# EasyEDA Pro project SimGEKI2_Side.epro

# Schematic Side New
Board Name: Side New; Create Date: 2025-03-21; Page Name: P1; Project Name: ongeki-controller; Schematic Name: Side New; Update Date: 2025-04-07; Company: 嘉立创EDA; Page Size: A4; Version: V1.3
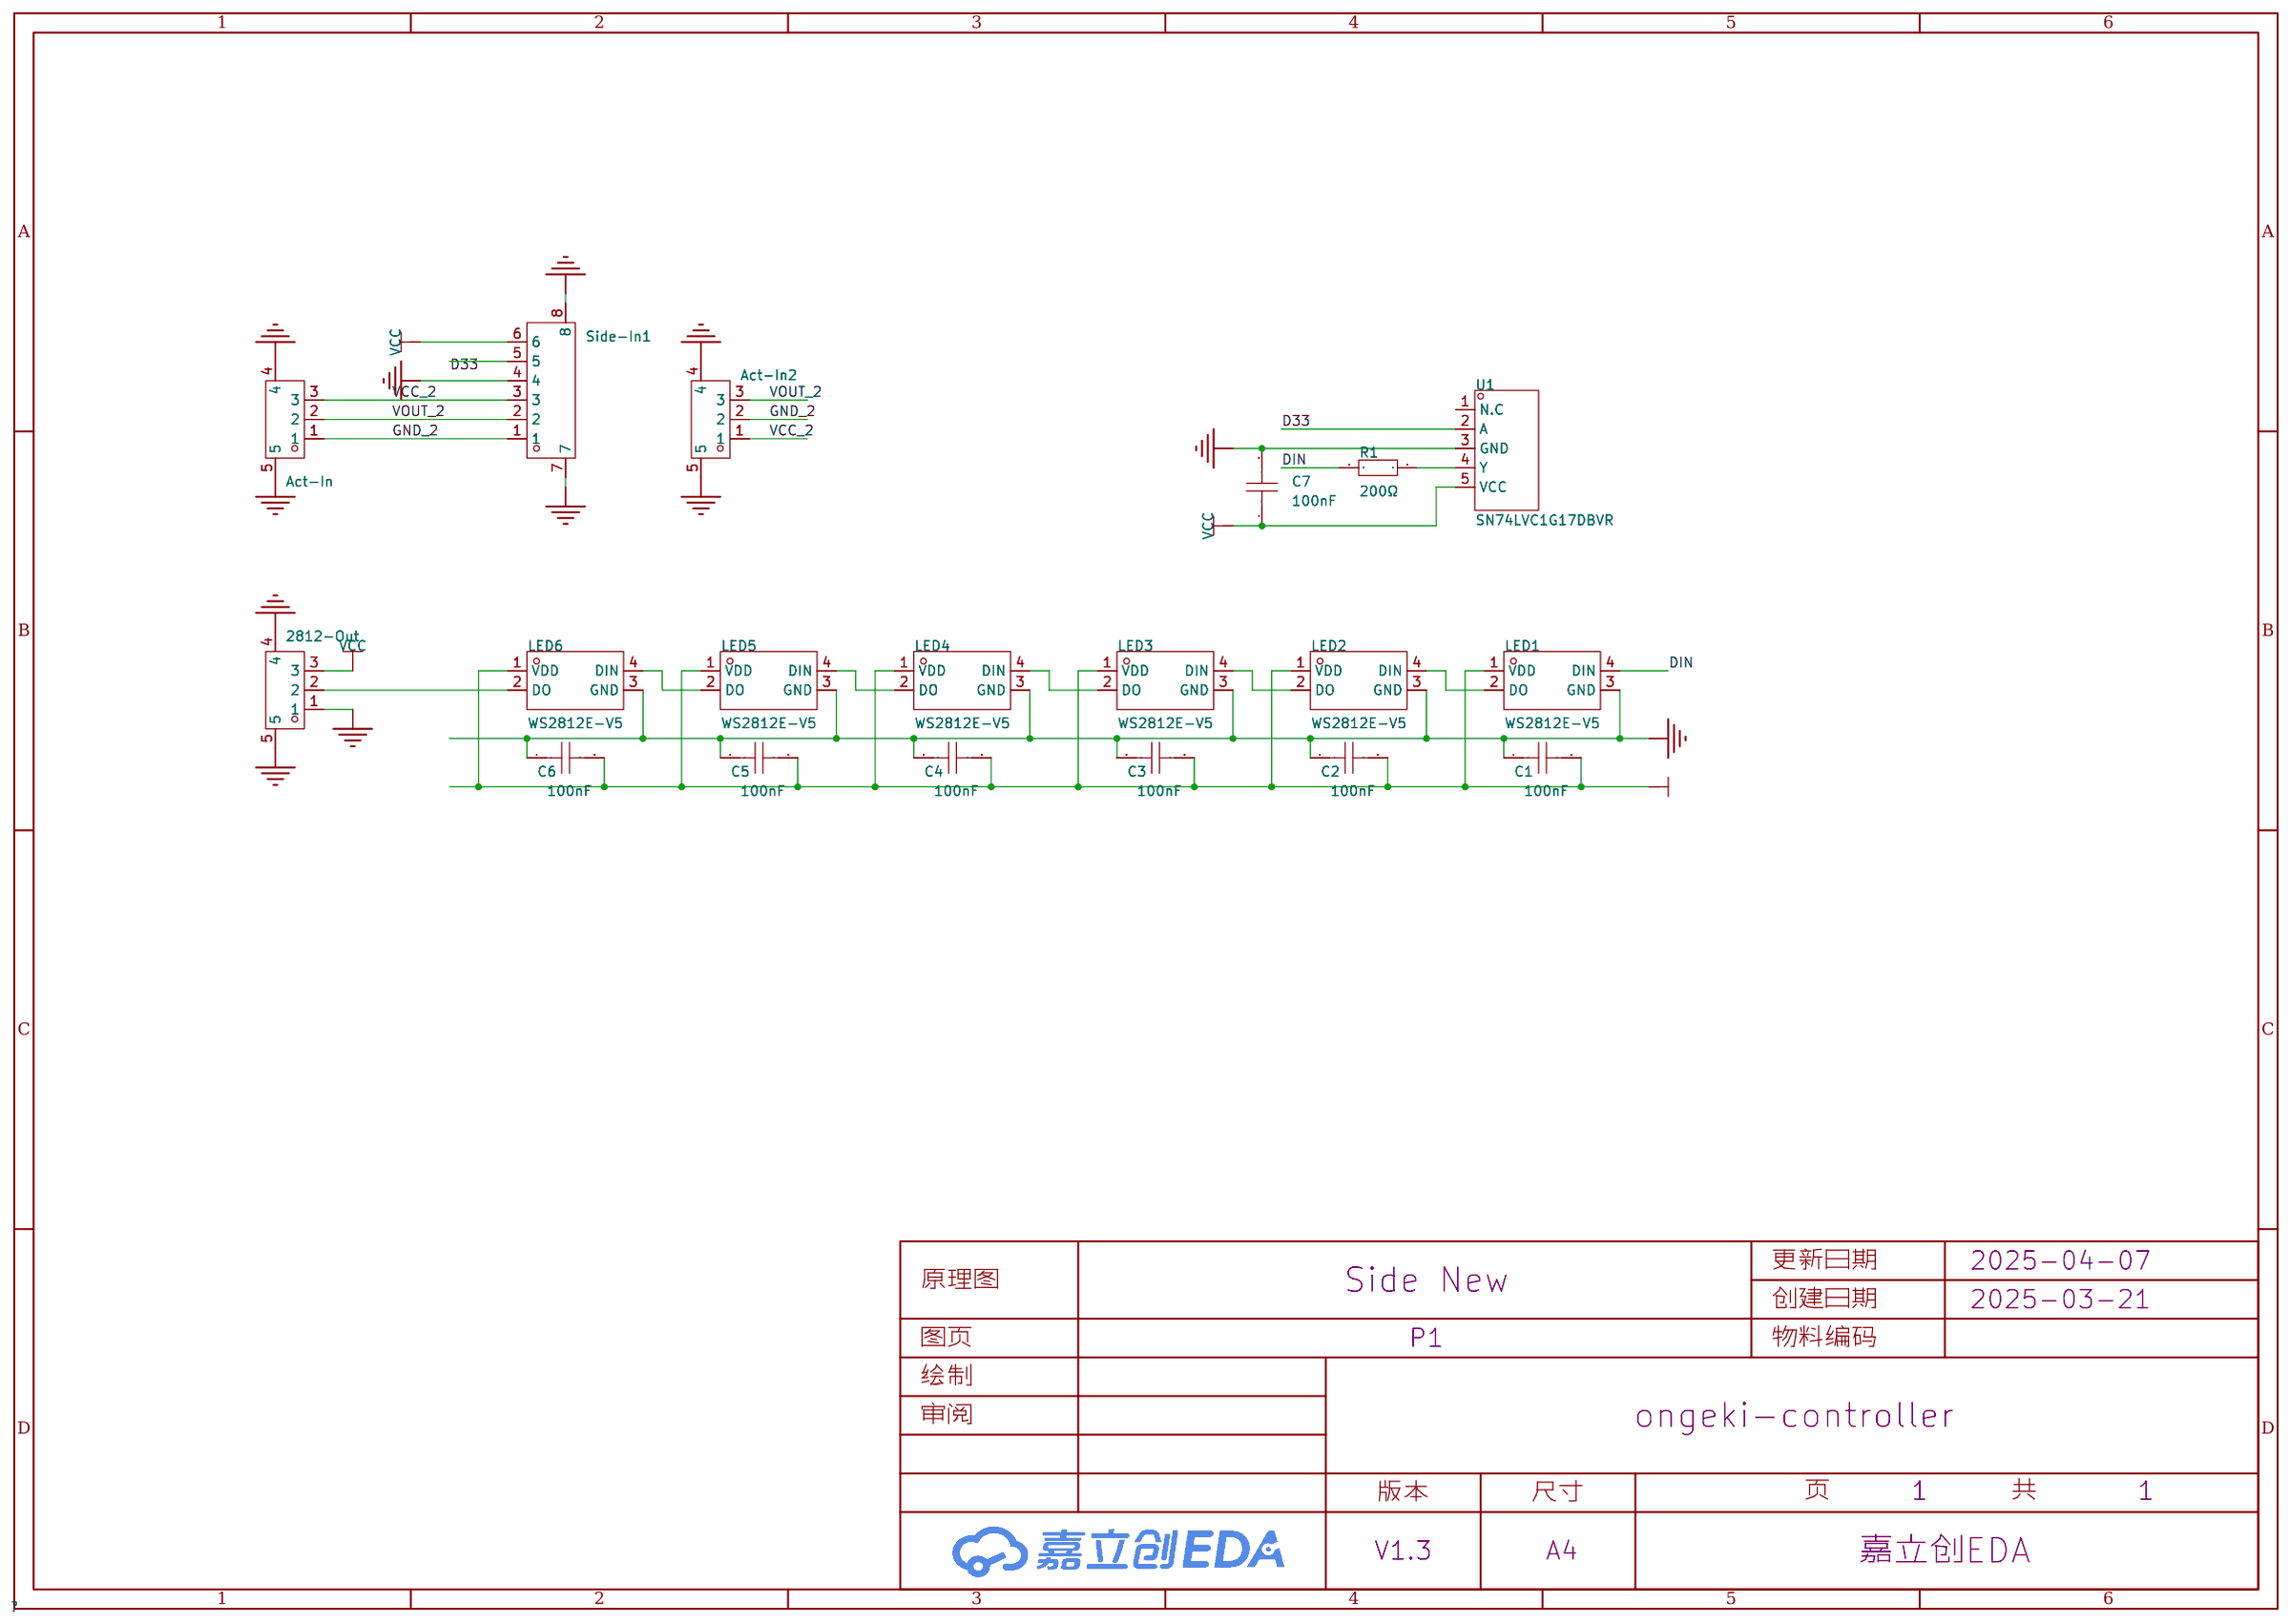
[diagram p0: schematic sheet]

## Parts
2812-Out  WAFER-PH2.0-3PWB  [CONN-SMD_3P-P2.00_XUNPU_WAFER-PH2.0-3PWB]
Act-In  WAFER-PH2.0-3PWB  [CONN-SMD_3P-P2.00_XUNPU_WAFER-PH2.0-3PWB]
Act-In2  Act-In2  [CONN-SMD_3P-P2.50_BX-XH2.54-3PWT]
C1  100nF  [C0603]
C2  100nF  [C0603]
C3  100nF  [C0603]
C4  100nF  [C0603]
C5  100nF  [C0603]
C6  100nF  [C0603]
C7  100nF  [C0603]
LED1  WS2812E-V5  [LED-SMD_4P-L5.0-W5.0-LS5.4-TL-1]
LED2  WS2812E-V5  [LED-SMD_4P-L5.0-W5.0-LS5.4-TL-1]
LED3  WS2812E-V5  [LED-SMD_4P-L5.0-W5.0-LS5.4-TL-1]
LED4  WS2812E-V5  [LED-SMD_4P-L5.0-W5.0-LS5.4-TL-1]
LED5  WS2812E-V5  [LED-SMD_4P-L5.0-W5.0-LS5.4-TL-1]
LED6  WS2812E-V5  [LED-SMD_4P-L5.0-W5.0-LS5.4-TL-1]
R1  200Ω  [R0603]
Side-In1  WAFER-PH2.0-6PWB  [CONN-SMD_6P-P2.00_XUNPU_WAFER-PH2.0-6PWB]
U1  SN74LVC1G17DBVR  [SOT-23-5_L3.0-W1.7-P0.95-LS2.8-BR]

## Library data of the parts
2812-Out Act-In = WAFER-PH2.0-3PWB: 插针结构:1x3P;间距:2mm;安装方式:卧贴;总PIN数:3P;排数:1;每排PIN数:3;额定电流:2A;工作温度范围:-25℃~+85℃;; LCSC Part Name: 1x3P 间距:2mm 卧贴; Supplier Part: C3029441; Manufacturer: XUNPU(讯普); Supplier Footprint: SMD,P=2mm,卧贴; JLCPCB Part Class: 扩展库; Datasheet: https://atta.szlcsc.com/upload/public/pdf/source/20220527/83903C18429EFE4C9EEE8C529A248431.pdf; Supplier: LCSC; Pins Structure: 1x3P; Pitch: 2mm; Mounting Style: 卧贴; Number of Pins: 3P; Number of Rows: 1; Number of PINs Per Row: 3; Current Rating (Max): 2A; Operating Temperature Range: -25℃~+85℃
Act-In2 = BX-XH2.54-3PWT: 插针结构:1x3P;间距:2.54mm;安装方式:卧贴;参考系列:XH;总PIN数:3P;排数:1;每排PIN数:3;行距:-;额定电流:3A;触头材质:黄铜;触头镀层:锡;工作温度范围:-25℃~+85℃;; Supplier Part: C18077873; Manufacturer: Bossie(博锡); Supplier Footprint: SMD,P=2.54mm,卧贴; JLCPCB Part Class: 扩展库; Datasheet: https://atta.szlcsc.com/upload/public/pdf/source/20231017/EDA27ED746708C958B6F1C9F7AF7FBE7.pdf; Supplier: LCSC; Pins Structure: 1x3P; Pitch: 2.54mm; Mounting Style: 卧贴; Reference Series: XH; Number of Pins: 3P; Number of Rows: 1; Number of PINs Per Row: 3; Current Rating (Max): 3A; Contact Material: 黄铜; Contact Plating: 锡; Operating Temperature Range: -25℃~+85℃
C1-C7 = CAP_0603: Supplier Footprint: 0603
LED1-LED6 = WS2812E-V5: 发光颜色:RGB三色;功率:-;正向电流:12.5mA;主波长:623nm；451nm；523nm;二极管配置:-;透镜颜色:-;色温:-;发光角度:-;载带方式:-;工作温度:-;; LCSC Part Name: RGB三色; Supplier Part: C2920042; Manufacturer: worldsemi; Supplier Footprint: SMD5050; JLCPCB Part Class: 扩展库; Datasheet: https://atta.szlcsc.com/upload/public/pdf/source/20211117/0464A411C41E6FA3BF6C3A8020ED01CE.pdf; Supplier: LCSC; Emitted Color: RGB三色; Forward Current: 12.5mA; Dominant Wavelength: 623nm；451nm；523nm
R1 = Res_0603: Supplier Footprint: 0603
Side-In1 = WAFER-PH2.0-6PWB: 插针结构:1x6P;间距:2mm;安装方式:卧贴;参考系列:PH;总PIN数:6P;排数:1;每排PIN数:6;行距:-;额定电流:2A;触头材质:黄铜;触头镀层:-;工作温度:-25℃~+85℃;; LCSC Part Name: 1x6P 间距:2mm 卧贴 系列:PH; Supplier Part: C3029444; Manufacturer: XUNPU(讯普); Supplier Footprint: SMD,P=2mm,卧贴; JLCPCB Part Class: Extended Part; Datasheet: https://atta.szlcsc.com/upload/public/pdf/source/20220527/83903C18429EFE4C9EEE8C529A248431.pdf; Supplier: LCSC; Pins Structure: 1x6P; Pitch: 2mm; Mounting Type: 卧贴; Reference Series: PH; Number of Pins: 6P; Number of Rows: 1; Number of PINs Per Row: 6; Current Rating: 2A; Contact Material: 黄铜; Operating Temperature: -25℃~+85℃; Voltage Rating: 250V; Plastic Material: LCP; Supplementary Features: 辅助焊脚; Color: 米色; Z-Height of the Board: 5.6mm; X-Length of Bottom Edge on Board (Spacing Line): 16mm; Y-Width of Bottom Edge on Board: 8.5mm
U1 = SN74LVC1G17DBVR: 输入类型:施密特触发器;电源电压:1.65V~5.5V;元件数:1;每个元件位数:1;灌电流(IOL):32mA;拉电流(IOH):32mA;; Supplier Part: C7836; Manufacturer: TI(德州仪器); Supplier Footprint: SOT-23-5; JLCPCB Part Class: 扩展库; Datasheet: https://www.ti.com/cn/lit/gpn/sn74lvc1g17; Supplier: LCSC; Input type: 施密特触发器; output type: 推挽; Supply Voltage: 1.65V~5.5V; Number of Elements: 1; Number of Bits per Element: 1; Sink Current: 32mA; Source Current: 32mA; Logic Family: 74LVC; Operating Temperature: -40℃~+125℃

## Nets
GND: 2812-Out.1 2812-Out.4 2812-Out.5 Act-In.4 Act-In.5 Act-In2.4 Act-In2.5 C1.1 C2.1 C3.1 C4.1 C5.1 C6.1 C7.2 LED1.3(GND) LED2.3(GND) LED3.3(GND) LED4.3(GND) LED5.3(GND) LED6.3(GND) Side-In1.4 Side-In1.7 Side-In1.8 U1.3(GND)
GND_2: Act-In.1 Act-In2.2 Side-In1.1
VCC: 2812-Out.3 C1.2 C2.2 C3.2 C4.2 C5.2 C6.2 C7.1 LED1.1(VDD) LED2.1(VDD) LED3.1(VDD) LED4.1(VDD) LED5.1(VDD) LED6.1(VDD) Side-In1.6 U1.5(VCC)
VCC_2: Act-In.3 Act-In2.1 Side-In1.3
D33: Side-In1.5 U1.2(A)
DIN: LED1.4(DIN) R1.1
VOUT_2: Act-In.2 Act-In2.3 Side-In1.2
$1N4040: R1.2 U1.4(Y)
$1N4683: LED2.2(DO) LED3.4(DIN)
$1N4689: LED3.2(DO) LED4.4(DIN)
$1N4696: LED4.2(DO) LED5.4(DIN)
$1N4703: LED5.2(DO) LED6.4(DIN)
$1N4717: LED1.2(DO) LED2.4(DIN)
$1N5589: 2812-Out.2 LED6.2(DO)

Not connected (* = marked no-connect by the designer): U1 1(N.C)

# Board Side New
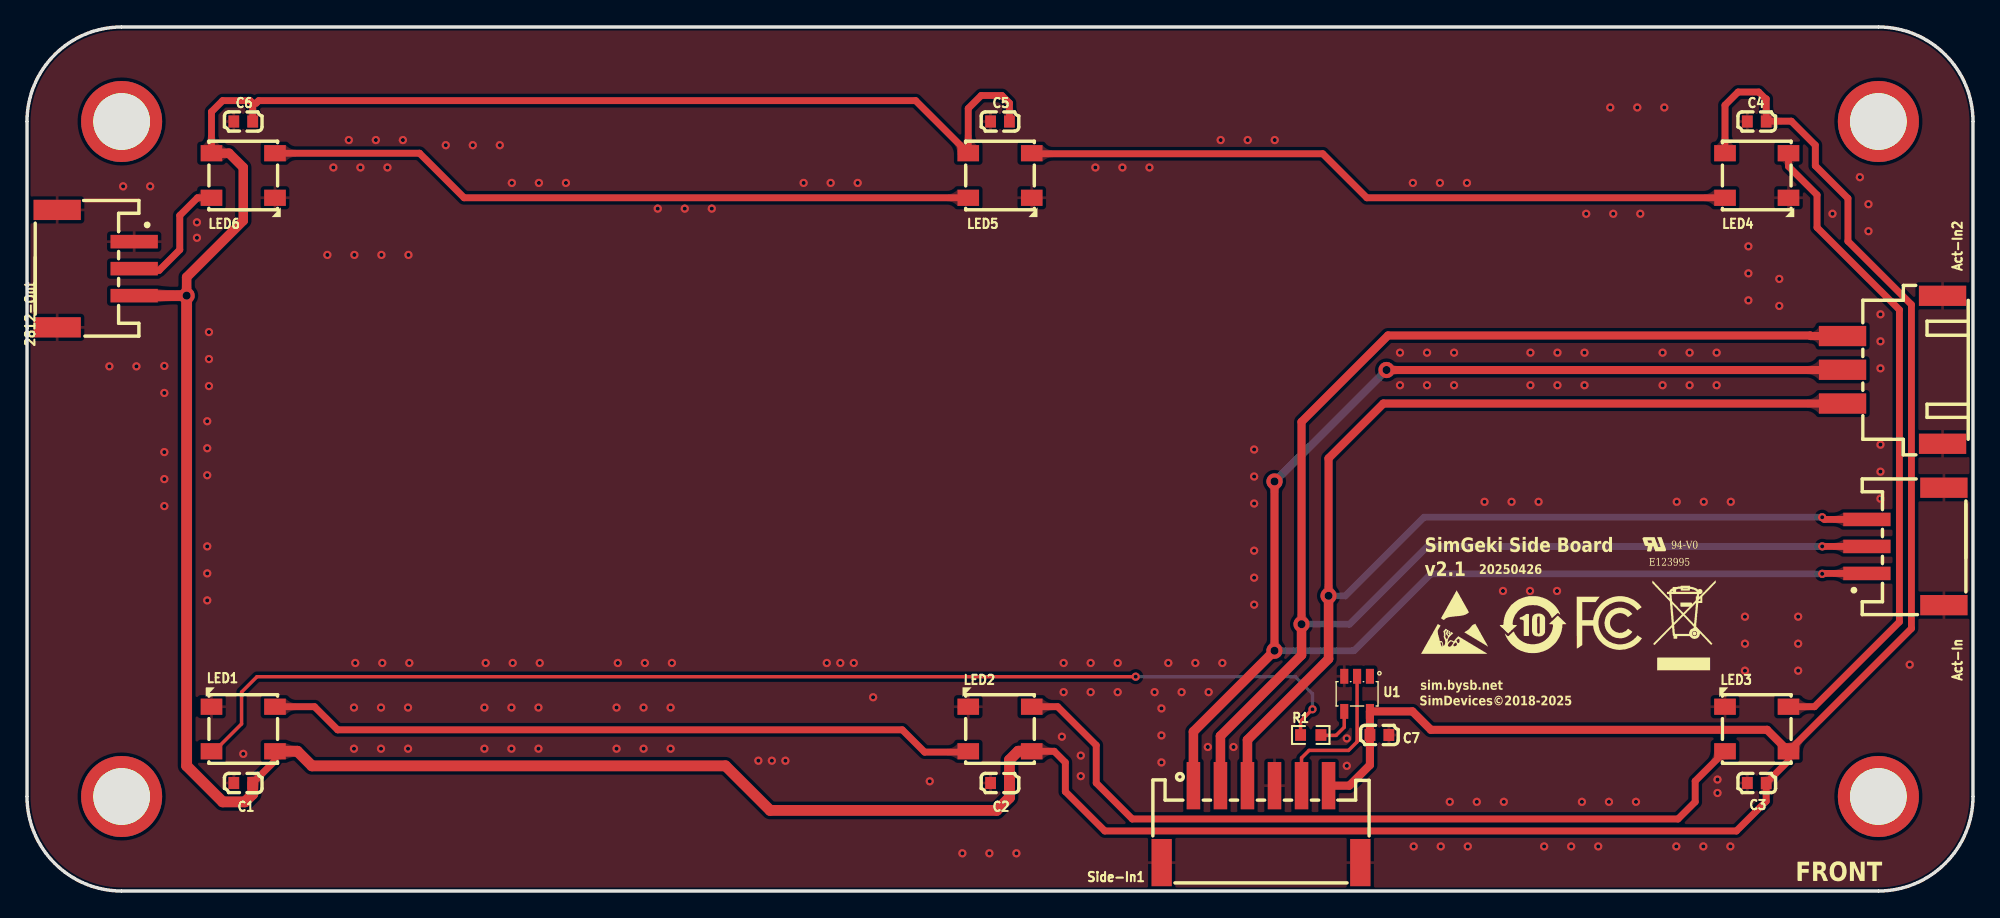
[diagram p1: board, top side]
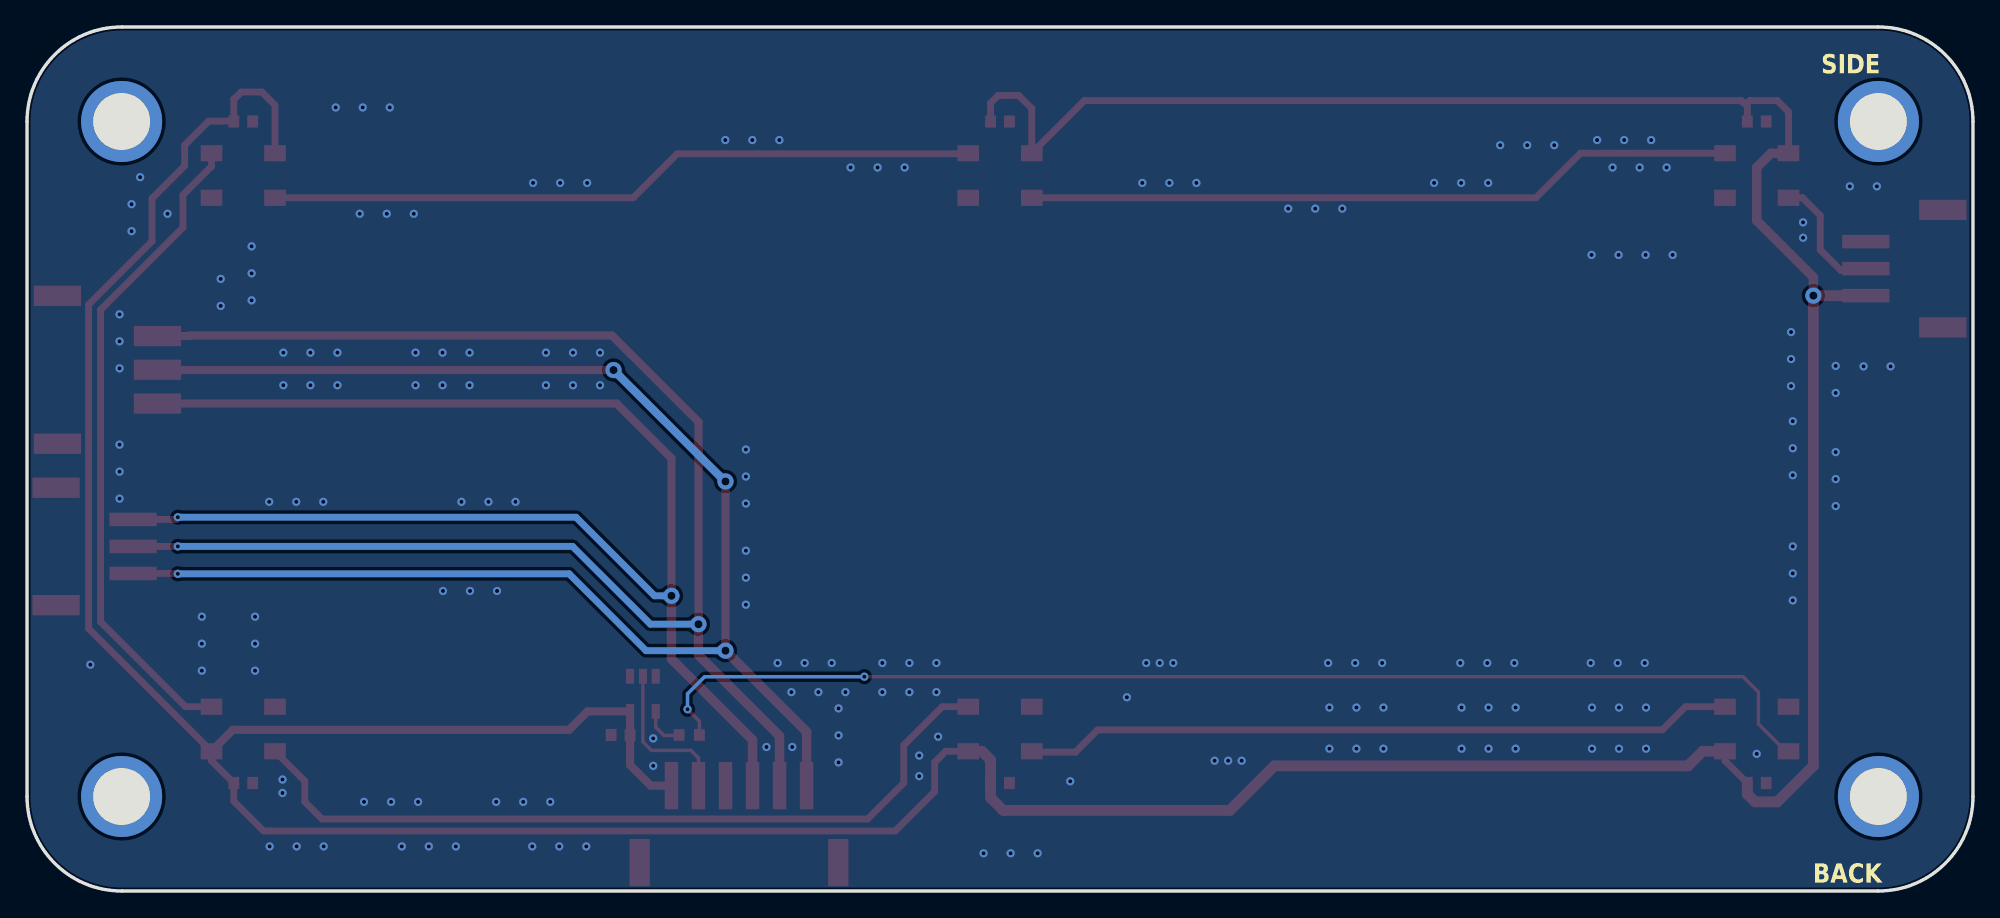
[diagram p2: board, bottom side, seen from below]

Outline 144 x 64 mm; copper layers: Top Layer, Bottom Layer. Coordinates in mm from the lower left corner of the outline.
Outline path: 0,57 0,7 arc(2.05,2.05) 7,0 137,0 arc(141.95,2.05) 144,7 144,57 arc(141.95,61.95) 137,64 7,64 arc(2.05,61.95) 0,57
Stack: Top Layer 0.035mm / Dielectric1 1.51mm FR4 er 4.5 / Bottom Layer 0.035mm

## Design rules (mm)
template: JLCPCB Capability(Two Layers Board)
spacing copperThickness1oz (default): track to track 0.102, other pairs 0.152 to 0.3
spacing copperThickness2oz: track to track 0.203, other pairs 0.152 to 0.3
track width copperThickness1oz (default): min 0.127, default 0.254, max 2.54
track width copperThickness2oz: min 0.203, default 0.254, max 2.54
differential pair differentialPair (default): width min 0.127, default 0.254, max 2.54; gap min 0.152, default 0.152
via viaSize (default): diameter min 0.5, default 0.61, max 10; hole min 0.3, default 0.305, max 6.3

## Placement (name value [footprint] x y rotation side)
2812-Out  WAFER-PH2.0-3PWB  [CONN-SMD_3P-P2.00_XUNPU_WAFER-PH2.0-3PWB]  5.08 46.1 270 top
Act-In  WAFER-PH2.0-3PWB  [CONN-SMD_3P-P2.00_XUNPU_WAFER-PH2.0-3PWB]  139 25.52 90 top
Act-In2  Act-In2  [CONN-SMD_3P-P2.50_BX-XH2.54-3PWT]  138.05 38.61 90 top
C1  100nF  [C0603]  16 8 0 top
C2  100nF  [C0603]  72 8 0 top
C3  100nF  [C0603]  128 8 0 top
C4  100nF  [C0603]  128 57 0 top
C5  100nF  [C0603]  72 57 0 top
C6  100nF  [C0603]  16 57 0 top
C7  100nF  [C0603]  100.08 11.56 0 top
LED1  WS2812E-V5  [LED-SMD_4P-L5.0-W5.0-LS5.4-TL-1]  16 12 180 top
LED2  WS2812E-V5  [LED-SMD_4P-L5.0-W5.0-LS5.4-TL-1]  72 12 180 top
LED3  WS2812E-V5  [LED-SMD_4P-L5.0-W5.0-LS5.4-TL-1]  128 12 180 top
LED4  WS2812E-V5  [LED-SMD_4P-L5.0-W5.0-LS5.4-TL-1]  128 53 0 top
LED5  WS2812E-V5  [LED-SMD_4P-L5.0-W5.0-LS5.4-TL-1]  72 53 0 top
LED6  WS2812E-V5  [LED-SMD_4P-L5.0-W5.0-LS5.4-TL-1]  16 53 0 top
NOREF  -  [Pad_e21]  7 57 0 top
NOREF#2  -  [Pad_e22]  137 57 0 top
NOREF#3  -  [Pad_e19]  7 7 0 top
NOREF#4  -  [Pad_e23]  137 7 0 top
R1  200Ω  [R0603]  95 11.56 0 top
Side-In1  WAFER-PH2.0-6PWB  [CONN-SMD_6P-P2.00_XUNPU_WAFER-PH2.0-6PWB]  91.31 4.95 0 top
U1  SN74LVC1G17DBVR  [SOT-23-5_L3.0-W1.7-P0.95-LS2.8-BR]  98.43 14.61 90 top

## Footprints (pads in the part's own frame, mm; a bottom-side part is the same pattern mirrored in y, then rotated)
C0603
  rect 0.8x0.9 smd: 1(-0.7,0) 2(0.7,0)
CONN-SMD_3P-P2.00_XUNPU_WAFER-PH2.0-3PWB
  rect 1x3.5 smd: 1(-2,2.85) 2(0,2.85) 3(2,2.85)
  rect 1.5x3.5 smd: 4(4.35,-2.85) 5(-4.35,-2.85)
CONN-SMD_3P-P2.50_BX-XH2.54-3PWT
  rect 1.5x3.5 smd: 1(-2.5,3.7) 2(0,3.7) 3(2.5,3.7) 4(5.48,-3.7) 5(-5.48,-3.7)
CONN-SMD_6P-P2.00_XUNPU_WAFER-PH2.0-6PWB
  rect 1x3.5 smd: 1(-5,2.85) 2(-3,2.85) 3(-1,2.85) 4(1,2.85) 5(3,2.85) 6(5,2.85)
  rect 1.5x3.5 smd: 7(-7.35,-2.85) 8(7.35,-2.85)
LED-SMD_4P-L5.0-W5.0-LS5.4-TL-1
  rect 1.6x1.2 smd: 1(-2.35,1.65) 2(-2.35,-1.65) 3(2.35,-1.65) 4(2.35,1.65)
Pad_e19
  round 6 hole 4.2: 6(0,0)
Pad_e21
  round 6 hole 4.2: 6(0,0)
Pad_e22
  round 6 hole 4.2: 6(0,0)
Pad_e23
  round 6 hole 4.2: 6(0,0)
R0603
  rect 0.806x0.864 smd: 1(-0.753,0) 2(0.753,0)
SOT-23-5_L3.0-W1.7-P0.95-LS2.8-BR
  rect 1.1x0.6 smd: 1(1.3,-0.95) 2(1.3,0) 3(1.3,0.95) 4(-1.3,0.95) 5(-1.3,-0.95)

## Nets
As in the schematic.

Pads without a net: NOREF 6; NOREF#2 6; NOREF#3 6; NOREF#4 6; U1 1

## Via types
v1: diameter 1.2, hole 0.6, Top Layer to Bottom Layer, 6 vias
v2: diameter 0.61, hole 0.305, Top Layer to Bottom Layer, 195 vias

## Routing (per net, layer and track width the routed paths; a pad name or vN(x,y) marks a point on that pad's centre or on a via; arc(x,y) is an arc through that point)
GND:
  vias: v2(6.1,38.86) v2(7.11,52.2) v2(8.1,38.86) v2(9.11,52.2) v2(10.16,38.89) v2(10.16,36.89) v2(10.16,32.51) v2(10.16,30.51) v2(10.16,28.51) v2(12.57,49.53) v2(12.57,48.39) v2(13.33,34.8) v2(13.33,32.8) v2(13.33,30.8) v2(13.33,25.53) v2(13.33,23.53) v2(13.33,21.53) v2(13.46,41.4) v2(13.46,39.4) v2(13.46,37.4) v2(16,10.16) v2(22.22,47.12) v2(22.67,53.59) v2(23.81,55.63) v2(24.22,47.12) v2(24.19,13.59) v2(24.19,10.54) v2(24.29,16.89) v2(24.67,53.59) v2(25.81,55.63) v2(26.22,47.12) v2(26.19,13.59) v2(26.19,10.54) v2(26.29,16.89) v2(26.67,53.59) v2(27.81,55.63) v2(28.22,47.12) v2(28.19,13.59) v2(28.19,10.54) v2(28.29,16.89) v2(30.99,55.25) v2(32.99,55.25) v2(33.85,13.59) v2(33.85,10.54) v2(33.94,16.89) v2(34.99,55.25) v2(35.85,13.59) v2(35.85,10.54) v2(35.88,52.45) v2(35.94,16.89) v2(37.85,13.59) v2(37.85,10.54) v2(37.88,52.45) v2(37.94,16.89) v2(39.88,52.45) v2(43.62,13.59) v2(43.62,10.54) v2(43.72,16.89) v2(45.62,13.59) v2(45.62,10.54) v2(45.72,16.89) v2(46.67,50.55) v2(47.62,13.59) v2(47.62,10.54) v2(47.72,16.89) v2(48.67,50.55) v2(50.67,50.55) v2(54.12,9.65) v2(55.12,9.65) v2(56.12,9.65) v2(57.47,52.45) v2(59.18,16.89) v2(59.47,52.45) v2(60.18,16.89) v2(61.18,16.89) v2(61.47,52.45) v2(62.61,14.35) v2(66.8,8.13) v2(69.22,2.79) v2(71.22,2.79) v2(73.22,2.79) v2(76.58,11.43) v2(76.71,16.89) v2(76.71,14.73) v2(77.98,10.03) v2(77.98,8.51) v2(78.71,16.89) v2(78.71,14.73) v2(79.06,53.59) v2(80.71,16.89) v2(80.71,14.73) v2(81.06,53.59) v2(83.06,53.59) v2(83.44,14.73) v2(83.95,13.53) v2(83.95,11.53) v2(83.95,9.53) v2(84.46,16.89) v2(85.44,14.73) v2(86.46,16.89) v2(87.44,14.73) v2(87.38,10.67) v2(88.33,55.63) v2(88.46,16.89) v2(89.28,10.67) v2(90.33,55.63) v2(90.81,32.7) v2(90.81,30.7) v2(90.81,28.7) v2(90.81,25.21) v2(90.81,23.21) v2(90.81,21.21) v2(92.33,55.63) v2(97.66,11.3) v2(97.66,9.27) v2(101.6,39.88) v2(101.6,37.47) v2(102.55,52.45) v2(102.62,3.3) v2(103.6,39.88) v2(103.6,37.47) v2(104.55,52.45) v2(104.62,3.3) v2(105.28,6.6) v2(105.6,39.88) v2(105.6,37.47) v2(106.55,52.45) v2(106.62,3.3) v2(107.28,6.6) v2(107.85,28.83) v2(109.22,22.22) v2(109.28,6.6) v2(109.85,28.83) v2(111.22,22.22) v2(111.25,39.88) v2(111.25,37.47) v2(111.85,28.83) v2(112.27,3.3) v2(113.22,22.22) v2(113.25,39.88) v2(113.25,37.47) v2(114.27,3.3) v2(115.06,6.6) v2(115.25,39.88) v2(115.25,37.47) v2(115.38,50.17) v2(116.27,3.3) v2(117.06,6.6) v2(117.16,58.04) v2(117.38,50.17) v2(119.06,6.6) v2(119.16,58.04) v2(119.38,50.17) v2(121.03,39.88) v2(121.03,37.47) v2(121.16,58.04) v2(122.05,3.3) v2(122.08,28.83) v2(123.03,39.88) v2(123.03,37.47) v2(124.05,3.3) v2(124.08,28.83) v2(125.03,39.88) v2(125.03,37.47) v2(125.09,8.25) v2(125.09,7.26) v2(126.05,3.3) v2(126.08,28.83) v2(127.13,20.32) v2(127.13,18.32) v2(127.13,16.32) v2(127.38,47.75) v2(127.38,45.75) v2(127.38,43.75) v2(129.67,45.34) v2(129.67,43.34) v2(131.06,20.32) v2(131.06,18.32) v2(131.06,16.32) v2(133.6,50.17) v2(135.63,52.88) v2(136.27,50.88) v2(136.27,48.88) v2(137.15,42.72) v2(137.15,40.72) v2(137.15,38.72) v2(137.15,33.06) v2(137.15,31.06) v2(137.15,29.06) v2(139.32,16.76)
GND_2: length 116.7
  Top Layer w0.508: Act-In.1 132.87,23.52 v2(132.84,23.5)
  Top Layer w0.6: 134.35,38.61 134.33,38.59 v1(100.6,38.59) ; v1(92.31,17.8) v1(92.31,30.34)
  Top Layer w0.7: v1(92.31,17.8) 86.31,11.8 Side-In1.1
  Bottom Layer w0.508: v2(132.84,23.5) 103.89,23.5 98.19,17.8 v1(92.31,17.8)
  Bottom Layer w0.6: v1(92.31,30.34) 92.35,30.34 v1(100.6,38.59)
VCC: length 363.1
  Top Layer w0.508: LED1.1 18.35,9.65 C1.2 ; LED6.1 13.65,57.72 14.48,58.55 16.51,58.55 16.7,58.36 ; 16.7,58.36 C6.2 ; 16.7,58.36 16.95,58.36 17.14,58.55 65.75,58.55 LED5.1 69.65,57.97 70.61,58.93 72.14,58.93 72.7,58.36 C5.2 ; LED2.1 76.01,10.35 76.84,9.53 76.84,7.37 79.76,4.44 126.49,4.44 128.7,6.65 C3.2 130.35,9.65 LED3.1 139.45,19.45 139.45,43.43 134.75,48.13 134.75,51.31 132.33,53.72 132.33,55.25 130.56,57.02 128.72,57.02 C4.2 128.7,58.67 128.65,58.67 128.14,59.18 126.62,59.18 125.65,58.21 LED4.1
  Top Layer w0.6: Side-In1.6 97.85,7.8 99.38,9.33 C7.1 U1.5 102.52,13.31 103.89,11.94 128.76,11.94 LED3.1
  Top Layer w0.7: LED6.1 14.95,54.65 16,53.59 16,49.66 11.81,45.47 v1(11.81,44.1)
  Top Layer w0.8: 2812-Out.3 v1(11.81,44.1) 11.81,9.27 14.48,6.6 16.13,6.6 16.7,7.18 C1.2 ; LED1.1 20,10.35 21.08,9.27 51.69,9.27 54.99,5.97 71.75,5.97 72.7,6.91 C2.2 72.7,9.71 73.34,10.35 LED2.1
VCC_2: length 108.8
  Top Layer w0.508: Act-In.3 133,27.52 v2(132.84,27.69)
  Top Layer w0.6: 134.35,36.11 100.37,36.11 96.31,32.05 v1(96.31,21.87)
  Top Layer w0.7: Side-In1.3 90.31,11.19 96.31,17.19 v1(96.31,21.87)
  Bottom Layer w0.508: v2(132.84,27.69) 103.38,27.69 97.56,21.87 v1(96.31,21.87)
D33: length 11.5
  Top Layer w0.254: Side-In1.5 94.31,9.86 94.87,10.41 97.79,10.41 98.43,11.05 U1.2
DIN: length 89.1
  Top Layer w0.254: v2(82.04,15.88) 17.02,15.88 15.88,14.73 15.88,12.38 13.85,10.35 LED1.4 ; R1.1 94.24,12.58 v2(95.12,13.46)
  Bottom Layer w0.254: v2(95.12,13.46) 95.12,14.61 93.85,15.88 v2(82.04,15.88)
VOUT_2: length 116.4
  Top Layer w0.508: Act-In.2 132.85,25.52 v2(132.84,25.53)
  Top Layer w0.6: 134.35,41.11 132,41.11 131.96,41.15 100.71,41.15 94.31,34.75 v1(94.31,19.76)
  Top Layer w0.7: Side-In1.2 88.31,11.48 94.31,17.48 v1(94.31,19.76)
  Bottom Layer w0.508: v2(132.84,25.53) 103.63,25.53 97.87,19.76 v1(94.31,19.76)
$1N4040: length 3.2
  Top Layer w0.254: U1.4 97.47,12.13 96.87,11.53 95.78,11.53 R1.2
$1N4683: length 59.4
  Top Layer w0.508: LED2.2 76.27,13.65 79.12,10.79 79.12,8 81.79,5.33 122.17,5.33 123.44,6.6 123.44,8.14 LED3.4
$1N4689: length 48.9
  Top Layer w0.508: LED4.4 130.35,53.67 132.46,51.56 132.46,49.15 138.56,43.05 138.56,19.94 132.27,13.65 LED3.2
$1N4696: length 52.7
  Top Layer w0.508: LED5.4 74.39,54.61 95.88,54.61 99.15,51.35 LED4.2
$1N4703: length 52.7
  Top Layer w0.508: LED6.4 29.04,54.65 32.34,51.35 LED5.2
$1N4717: length 52.7
  Top Layer w0.508: LED2.4 69.59,10.29 66.42,10.29 64.77,11.94 22.99,11.94 21.28,13.65 LED1.2
$1N5589: length 9.5
  Top Layer w0.508: LED6.2 12.61,51.35 11.3,50.04 11.3,47.5 9.78,45.97 8.06,45.97 2812-Out.2

## Copper pours and planes (outline as drawn; the poured copper is in the pictures)
GND on Top Layer: 0,64 144,64 144,0 0,0
GND on Bottom Layer: 0,64 144,64 144,0 0,0

Small or netless copper shapes (teardrops, artwork), in the pictures only: 49 on Top Layer, 8 on Bottom Layer

## Text on the board
Bottom Silkscreen Layer: BACK | SIDE
Top Solder Mask Layer: SimGeki | Side Board
Top Silkscreen Layer: JLCJLCJLCJLC | SimDevices©2018-2025 | sim.bysb.net | 20250426 | SimGeki Side Board | v2.1 | FRONT | E123995 | 94-V0
